# EAGLE design MusicGloves (EAGLE 9.6.2)
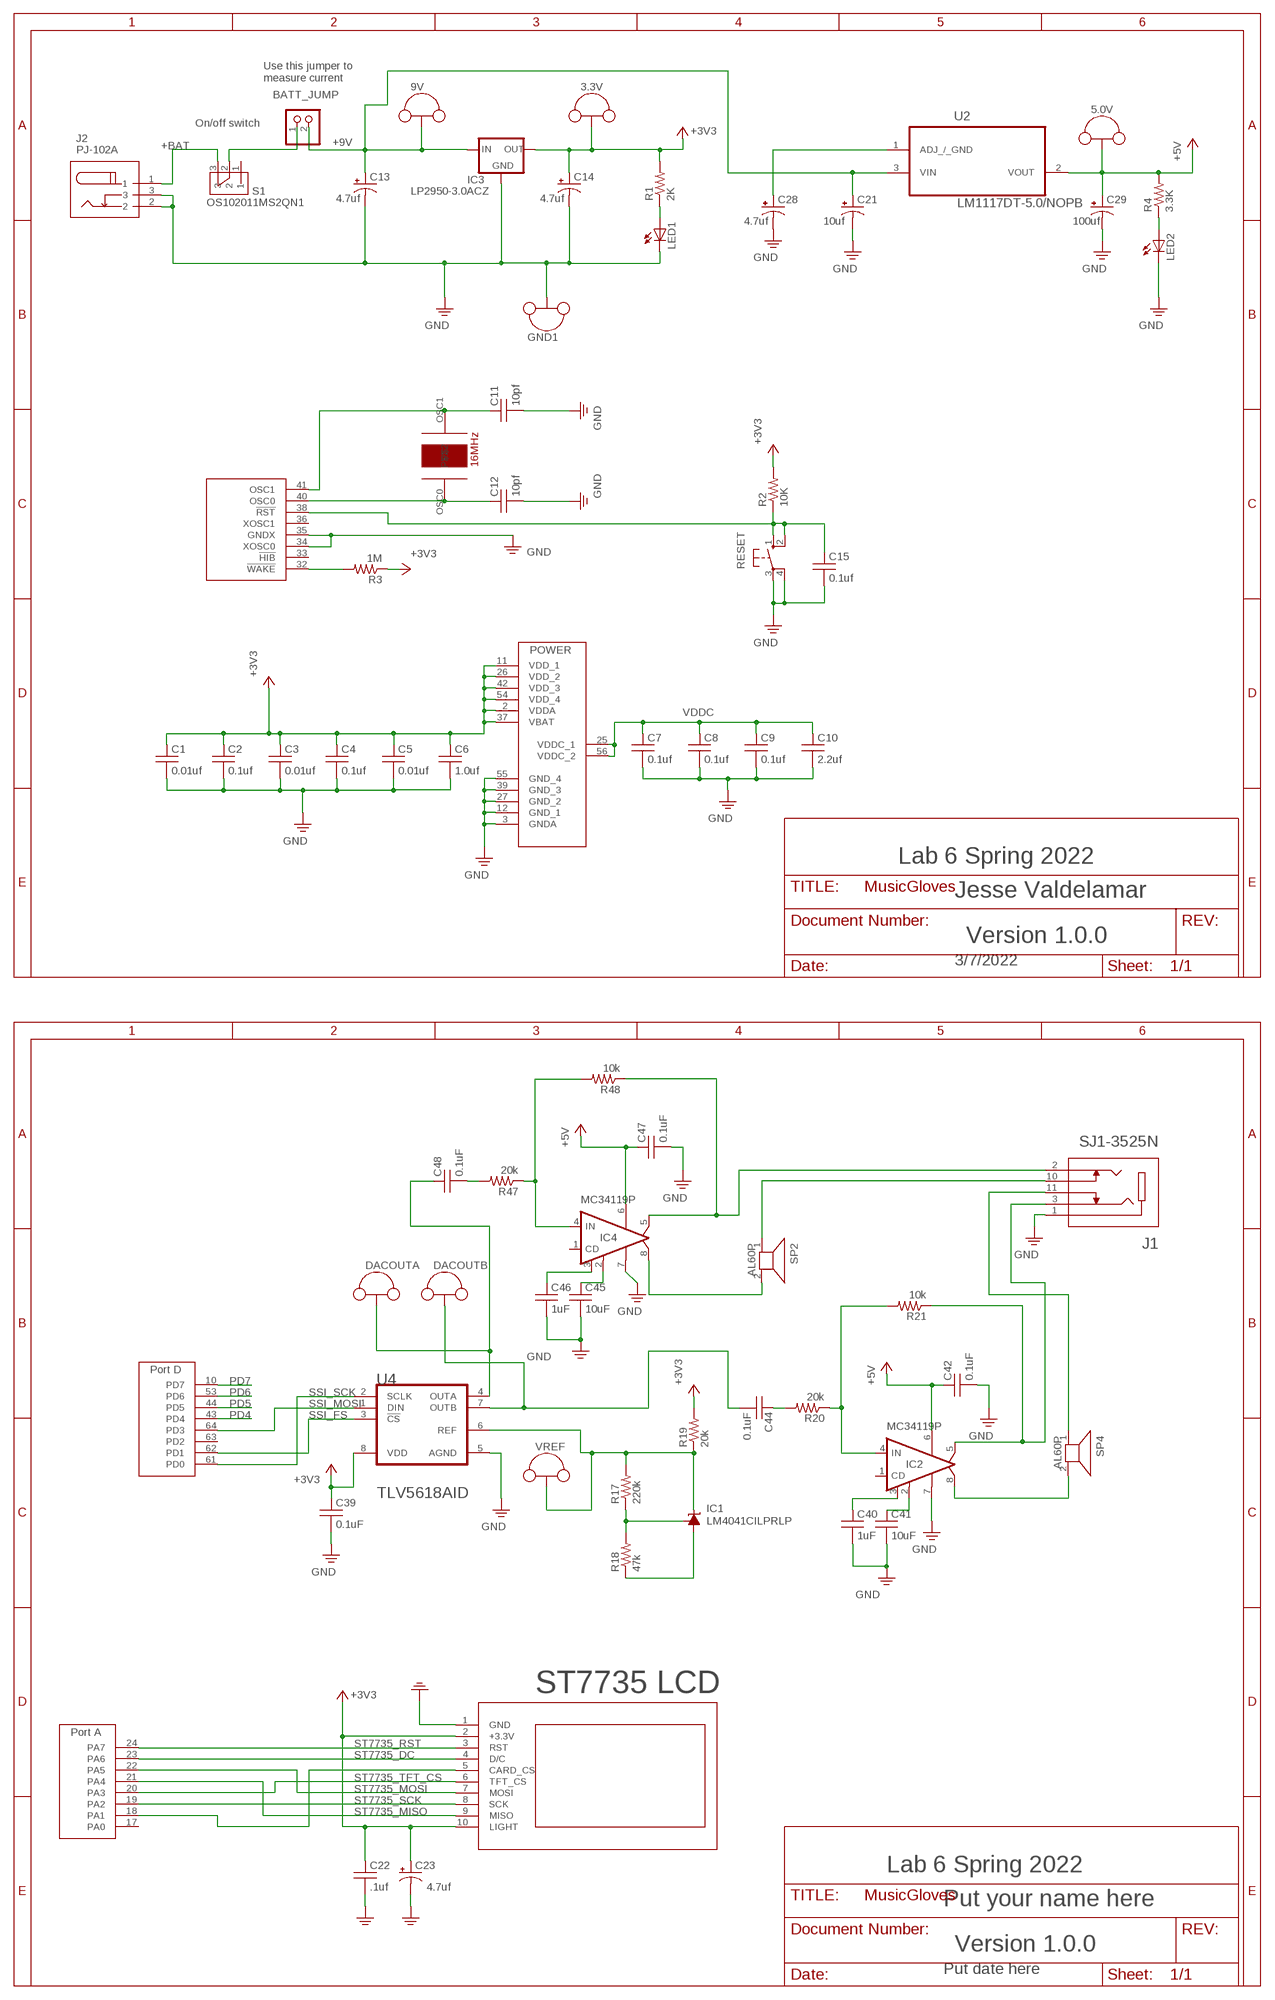
[diagram p0: schematic, sheet 1, part 1 of 2]
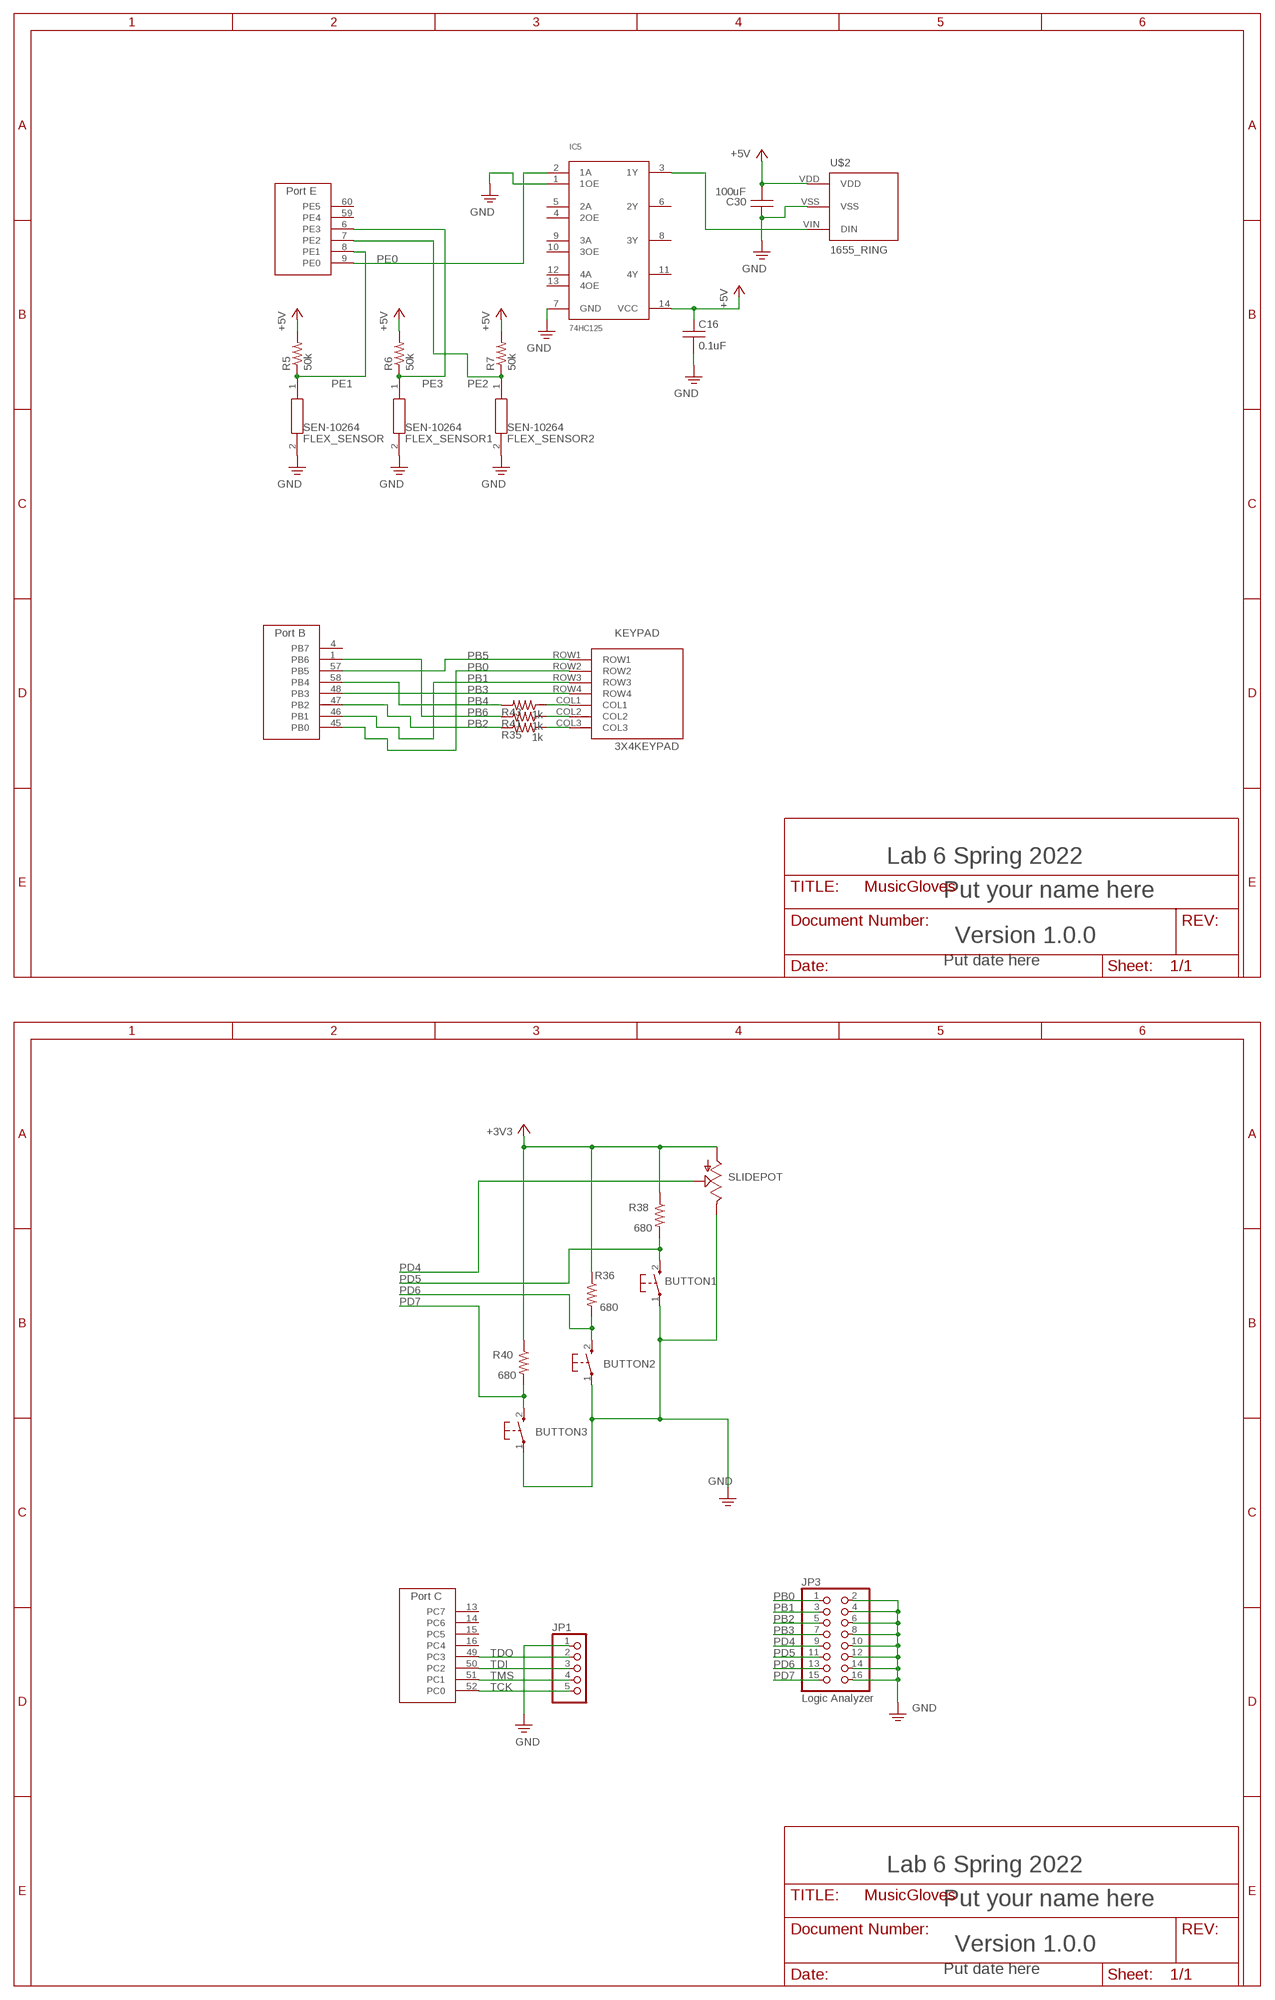
[diagram p1: schematic, sheet 1, part 2 of 2]

## Parts
3.3V  TP_LOOP  [TP_LOOP]
5.0V  TP_LOOP  [TP_LOOP]
9V  TP_LOOP  [TP_LOOP]
BATT_JUMP  PINHD-1X2  [1X02]
BUTTON1  B3F_1052_2HOLE  [B3F-10XX_2HOLE]
BUTTON2  B3F_1052_2HOLE  [B3F-10XX_2HOLE]
BUTTON3  B3F_1052_2HOLE  [B3F-10XX_2HOLE]
C1  0.01uf  CAPACITOR025-024X044  [CAP100MIL]
C2  0.1uf  CAPACITOR025-024X044  [CAP100MIL]
C3  0.01uf  CAPACITOR025-024X044  [CAP100MIL]
C4  0.1uf  CAPACITOR025-024X044  [CAP100MIL]
C5  0.01uf  CAPACITOR025-024X044  [CAP100MIL]
C6  1.0uf  CAPACITOR025-024X044  [CAP100MIL]
C7  0.1uf  CAPACITOR025-024X044  [CAP100MIL]
C8  0.1uf  CAPACITOR025-024X044  [CAP100MIL]
C9  0.1uf  CAPACITOR025-024X044  [CAP100MIL]
C10  2.2uf  CAPACITOR025-024X044  [CAP100MIL]
C11  10pf  CAPACITOR025-024X044  [CAP100MIL]
C12  10pf  CAPACITOR025-024X044  [CAP100MIL]
C13  4.7uf  CAPACITOR_POLARIZEDE5-6  [CAP200MILPOLARIZED]
C14  4.7uf  CAPACITOR_POLARIZEDE5-6  [CAP200MILPOLARIZED]
C15  0.1uf  CAPACITOR025-024X044  [CAP100MIL]
C16  0.1uF  CAPACITOR050-024X044  [CAP200MIL]
C21  10uf  CAPACITOR_POLARIZEDE5-6  [CAP200MILPOLARIZED]
C22  .1uf  CAPACITOR050-024X044  [CAP200MIL]
C23  4.7uf  CAPACITOR_POLARIZEDE5-6  [CAP200MILPOLARIZED]
C28  4.7uf  CAPACITOR_POLARIZEDE5-6  [CAP200MILPOLARIZED]
C29  100uf  CAPACITOR_POLARIZEDE5-6  [CAP200MILPOLARIZED]
C30  100uF  CAPACITOR050-024X044  [CAP200MIL]
C39  0.1uF  CAPACITOR050-024X044  [CAP200MIL]
C40  1uF  CAPACITOR050-024X044  [CAP200MIL]
C41  10uF  CAPACITOR050-024X044  [CAP200MIL]
C42  0.1uF  CAPACITOR050-024X044  [CAP200MIL]
C44  0.1uF  CAPACITOR050-024X044  [CAP200MIL]
C45  10uF  CAPACITOR050-024X044  [CAP200MIL]
C46  1uF  CAPACITOR050-024X044  [CAP200MIL]
C47  0.1uF  CAPACITOR050-024X044  [CAP200MIL]
C48  0.1uF  CAPACITOR050-024X044  [CAP200MIL]
DACOUTA  TP_LOOP  [TP_LOOP]
DACOUTB  TP_LOOP  [TP_LOOP]
FLEX_SENSOR  SEN-10264  [RESAD2700W1900L700D500]
FLEX_SENSOR1  SEN-10264  [RESAD2700W1900L700D500]
FLEX_SENSOR2  SEN-10264  [RESAD2700W1900L700D500]
GND1  TP_LOOP  [TP_LOOP]
IC1  LM4041CILPRLP  [LP_O-PBCY-W3]
IC2  MC34119P  [DIL08]
IC3  LP2950-3.0ACZ  [TO92]
IC4  MC34119P  [DIL08]
IC5  74HC125  [SOIC-14]
J1  SJ1-3525N  [CUI_SJ1-3525N]
J2  PJ-102A  [PJ-102AH]
JP1  PINHD-1X5  [1X05]
JP3  Logic Analyzer  PINHD-2X8  [2X08]
KEYPAD  3X4KEYPAD  [3X4KEYPAD]
LED1  LED3MM  [LED3MM]
LED2  LED3MM  [LED3MM]
R1  2K  RESISTOR0204/5  [RES200MIL]
R2  10K  RESISTOR0204/5  [RES200MIL]
R3  1M  RESISTOR0204/5  [RES200MIL]
R4  3.3K  RESISTOR0204/5  [RES200MIL]
R5  50k  RESISTOR0204/5  [RES200MIL]
R6  50k  RESISTOR0204/5  [RES200MIL]
R7  50k  RESISTOR0204/5  [RES200MIL]
R17  220k  RESISTOR0204/5  [RES200MIL]
R18  47k  RESISTOR0204/5  [RES200MIL]
R19  20k  RESISTOR0204/5  [RES200MIL]
R20  20k  RESISTOR0204/5  [RES200MIL]
R21  10k  RESISTOR0204/5  [RES200MIL]
R35  1k  R-US_0204/5  [0204/5]
R36  680  R-US_0204/5  [0204/5]
R38  680  R-US_0204/5  [0204/5]
R40  680  R-US_0204/5  [0204/5]
R41  1k  R-US_0204/5  [0204/5]
R43  1k  R-US_0204/5  [0204/5]
R47  20k  RESISTOR0204/5  [RES200MIL]
R48  10k  RESISTOR0204/5  [RES200MIL]
RESET  B3F-1052  [B3F-10XX]
S1  OS102011MS2QN1  [SW_OS102011MS2QN1]
SLIDEPOT  POTENTIOMETER_PTA2043B25U  [PTA2043]
SP2  AL60P  [AL60P]
SP4  AL60P  [AL60P]
U1  TM4C123GH6PM  [QFP50P1200X1200X160-64N]
U2  LM1117DT-5.0/NOPB  [TO228P970X238-3N]
U4  TEXAS_INSTRUMENTS_TLV5618AIDTEXAS_INSTRUMENTS_TLV5618AID_0_0  [TEXAS_INSTRUMENTS_TLV5618AID_0]
U$2  1655_RING  [LED_1655_RING]
U$3  ST7735  [ST7735]
VREF  TP_LOOP  [TP_LOOP]
Y1  16MHZ_CRYSTAL  [16MHZ_CRYSTAL]

## Nets
+3V1: IC1.2(C) R17.2 R19.1 U4.6(REF) VREF.P$1(TP) VREF.P$2(TP)
+3V2: C48.1 DACOUTA.P$1(TP) DACOUTA.P$2(TP) U4.4(OUTA)
+3V3: 3.3V.P$1(TP) 3.3V.P$2(TP) C1.1 C2.1 C3.1 C4.1 C5.1 C6.1 C14.+ C22.1 C23.+ C39.1 IC3.1(OUT) R1.2 R2.2 R3.1 R19.2 R36.1 R38.1 R40.1 SLIDEPOT.3(A) U1.2(VDDA) U1.11(VDD_1) U1.26(VDD_2) U1.37(VBAT) U1.42(VDD_3) U1.54(VDD_4) U4.8(VDD) U$3.2(+3.3V) U$3.10(LIGHT)
+3V4: C44.2 DACOUTB.P$1(TP) DACOUTB.P$2(TP) U4.7(OUTB)
+5V: 5.0V.P$1(TP) 5.0V.P$2(TP) C16.1 C29.+ C30.2 C42.1 C47.1 IC2.6(VCC) IC4.6(VCC) IC5.14(VCC) R4.2 R5.2 R6.2 R7.2 U2.2(VOUT) U$2.VDD
+9V: 9V.P$1(TP) 9V.P$2(TP) BATT_JUMP.2 C13.+ C21.+ IC3.3(IN) U2.3(VIN)
+BAT: J2.1 S1.3
COL1: KEYPAD.COL1 R43.1
COL2: KEYPAD.COL2 R41.1
COL3: KEYPAD.COL3 R35.1
GND: BUTTON1.1(P) BUTTON2.1(P) BUTTON3.1(P) C1.2 C2.2 C3.2 C4.2 C5.2 C6.2 C7.2 C8.2 C9.2 C10.2 C11.2 C12.2 C13.- C14.- C15.2 C16.2 C21.- C22.2 C23.- C28.- C29.- C30.1 C39.2 C40.2 C41.2 C42.2 C45.2 C46.2 C47.2 FLEX_SENSOR1.2 FLEX_SENSOR2.2 FLEX_SENSOR.2 GND1.P$1(TP) GND1.P$2(TP) IC2.7(GND) IC3.2(GND) IC4.7(GND) IC5.1(1OE) IC5.7(GND) J1.1 J2.2 J2.3 JP1.1 JP3.2 JP3.4 JP3.6 JP3.8 JP3.10 JP3.12 JP3.14 JP3.16 LED1.K(C) LED2.K(C) RESET.3(P) RESET.4(P1) SLIDEPOT.1(E) U1.3(GNDA) U1.12(GND_1) U1.27(GND_2) U1.34(XOSC0) U1.35(GNDX) U1.39(GND_3) U1.55(GND_4) U4.5(AGND) U$2.VSS U$3.1(GND)
N$1: J1.10 SP2.1
N$3: J1.11 SP4.1
N$4: C44.1 R20.2
N$5: C28.+ U2.1(ADJ_/_GND)
N$6: IC2.4(IN) R20.1 R21.2
N$9: IC2.8(VO2) SP4.2
N$10: C41.1 IC2.2(FC2)
N$12: C40.1 IC2.3(FC1)
N$13: U1.18(PA1) U$3.5(CARD_CS)
N$16: IC5.3(1Y) U$2.VIN(DIN)
N$30: C48.2 R47.2
N$65: IC4.4(IN) R47.1 R48.2
N$68: IC4.8(VO2) SP2.2
N$69: C45.1 IC4.2(FC2)
N$70: C46.1 IC4.3(FC1)
OSC0: C12.1 U1.40(OSC0) Y1.OSC0
OSC1: C11.1 U1.41(OSC1) Y1.OSC1
PB0: JP3.1 KEYPAD.ROW2 U1.45(PB0)
PB1: JP3.3 KEYPAD.ROW3 U1.46(PB1)
PB2: JP3.5 R35.2 U1.47(PB2)
PB3: JP3.7 KEYPAD.ROW4 U1.48(PB3)
PB4: R43.2 U1.58(PB4)
PB5: KEYPAD.ROW1 U1.57(PB5)
PB6: R41.2 U1.1(PB6)
PD4: JP3.9 SLIDEPOT.2(S) U1.43(PD4)
PD5: BUTTON1.2(S) JP3.11 R38.2 U1.44(PD5)
PD6: BUTTON2.2(S) JP3.13 R36.2 U1.53(PD6)
PD7: BUTTON3.2(S) JP3.15 R40.2 U1.10(PD7)
PE0: IC5.2(1A) U1.9(PE0)
PE1: FLEX_SENSOR.1 R5.1 U1.8(PE1)
PE2: FLEX_SENSOR2.1 R7.1 U1.7(PE2)
PE3: FLEX_SENSOR1.1 R6.1 U1.6(PE3)
POWERLED: LED1.A R1.1
POWERLED1: LED2.A R4.1
POWERLED3: IC4.5(VO1) J1.2 R48.1
POWERLED14: IC1.1(FB) R17.1 R18.2
POWERLED15: IC1.3(A) R18.1
POWERLED17: IC2.5(VO1) J1.3 R21.1
RESET: C15.1 R2.1 RESET.1(S) RESET.2(S1) U1.38(!RST)
SSI_FS: U1.62(PD1) U4.3(!CS!)
SSI_MOSI: U1.64(PD3) U4.1(DIN)
SSI_SCK: U1.61(PD0) U4.2(SCLK)
ST7735_DC: U1.23(PA6) U$3.4(D/C)
ST7735_MISO: U1.21(PA4) U$3.9(MISO)
ST7735_MOSI: U1.22(PA5) U$3.7(MOSI)
ST7735_RST: U1.24(PA7) U$3.3(RST)
ST7735_SCK: U1.19(PA2) U$3.8(SCK)
ST7735_TFT_CS: U1.20(PA3) U$3.6(TFT_CS)
SWITCHEDPOWER: BATT_JUMP.1 S1.2
TCK: JP1.5 U1.52(PC0)
TDI: JP1.3 U1.50(PC2)
TDO: JP1.2 U1.49(PC3)
TMS: JP1.4 U1.51(PC1)
VDDC: C7.1 C8.1 C9.1 C10.1 U1.25(VDDC_1) U1.56(VDDC_2)
WAKE: R3.2 U1.32(!WAKE)
Unconnected: IC2.1(CD) IC4.1(CD) IC5.4(2OE) IC5.5(2A) IC5.6(2Y) IC5.8(3Y) IC5.9(3A) IC5.10(3OE) IC5.11(4Y) IC5.12(4A) IC5.13(4OE) S1.1 U1.4(PB7) U1.5(PF4) U1.13(PC7) U1.14(PC6) U1.15(PC5) U1.16(PC4) U1.17(PA0) U1.28(PF0) U1.29(PF1) U1.30(PF2) U1.31(PF3) U1.33(!HIB) U1.36(XOSC1) U1.59(PE4) U1.60(PE5) U1.63(PD2)

## Notes on the sheet
- Use this jumper to
  measure current
- On/off switch
- Lab 6 Spring 2022 | Lab 6 Spring 2022
- Jesse Valdelamar | Put your name here
- Version 1.0.0 | Version 1.0.0
- 3/7/2022 | Put date here
- ST7735 LCD
- Lab 6 Spring 2022 | Lab 6 Spring 2022
- Put your name here | Put your name here
- Version 1.0.0 | Version 1.0.0
- Put date here | Put date here

## Library data of the parts
3.3V 5.0V 9V DACOUTA DACOUTB GND1 VREF = EE445L:TP_LOOP
BATT_JUMP = EE445L:PINHD-1X2: PIN HEADER
BUTTON1-BUTTON3 = EE445L:B3F_1052_2HOLE
C1-C12 C15 C16 C22 C30 C39-C42 C44-C48 = EE445L:CAPACITOR: CAPACITOR, American symbol
C13 C14 C21 C23 C28 C29 = EE445L:CAPACITOR_POLARIZED: POLARIZED CAPACITOR, American symbol
FLEX_SENSOR FLEX_SENSOR1 FLEX_SENSOR2 = SEN-10264:SEN-10264: Multiple Function Sensor Development Tools Flex Sensor 2.2"" Source: Datasheet <https://cdn.sparkfun.com/assets/9/5/b/f/7/FLEX_SENSOR_-_SPECIAL_EDITION_DATA_SHEET_v2019__Rev_A_.pdf>; DESCRIPTION: Multiple Function Sensor Development Tools Flex Sensor 2.2""; HEIGHT: mm; MANUFACTURER_NAME: SparkFun; MANUFACTURER_PART_NUMBER: SEN-10264
IC1 = LM4041CILPR:LM4041CILPR: PRECISION MICROPOWER SHUNT VOLTAGE REFERENCE Adjustable Output Source: http://focus.ti.com/lit/ds/slcs146e/slcs146e.pdf LM4041CILPR Let R1 be the resistor from Vref to +3.3V Let R2 be the resistor from Vref to FB Let R3 be the resistor from FB to ground Vref = 1.23*(1+R3/R2) Iref=(3.3V-Vref)/R1 - 100uA; DESCRIPTION: Adjustable, precision micropower shunt voltage reference with 0.5% accuracy 3-TO-92 -40 to 85; DIGI-KEY_PART_NUMBER: 296-22173-1-ND; MF: Texas Instruments; MP: LM4041CILPR; PACKAGE: TO-92-3 Texas Instruments; PURCHASE-URL: https://pricing.snapeda.com/search/part/LM4041CILPR/?ref=eda
IC2 IC4 = MC34119:MC34119: Low Power Audio Amplifier Motorola Check availability <https://pricing.snapeda.com/parts/MC34119/NXP%20Semiconductors/view-part?ref=eda>; AVAILABILITY: In Stock; DESCRIPTION: Amplifier IC 1-Channel (Mono) Class AB 8-TSSOP; MF: NXP Semiconductors; MP: MC34119; PACKAGE: TSSOP-8 NXP / Freescale; PRICE: None
IC3 = EE445L:LP2950: LP2950 3.3V regulator, 100 mA TO-92 On Semiconductor LP2950ACZ-3.3G, Mouser 863-LP2950ACZ-3.3G
IC5 = 74HC125:74HC125: Check availability <https://pricing.snapeda.com/parts/74HC125/Nexperia%20USA/view-part?ref=eda>; AVAILABILITY: In Stock; DESCRIPTION: Buffer, Non-Inverting 4 Element 1 Bit per Element 3-State Output 14-TSSOP; MF: Nexperia USA; MP: 74HC125; PACKAGE: SOIC-14 STMicroelectronics; PRICE: None; PURCHASE-URL: https://pricing.snapeda.com/search/part/74HC125/?ref=eda
J1 = SJ1-3525N:SJ1-3525N: 3.5 mm Right-Angle Stereo Jack, 5 Pin PCB Mount, Non-Threaded; MANUFACTURER: CUI; PARTREV: 1.02; STANDARD: Manufacturer recommendation
J2 = PJ-102A:PJ-102A: DC Power Connectors Power Jacks Source: Datasheet <https://www.cui.com/product/resource/pj-102a.pdf>; DESCRIPTION: DC Power Connectors Power Jacks; HEIGHT: mm; MANUFACTURER_NAME: CUI Inc.; MANUFACTURER_PART_NUMBER: PJ-102A; MOUSER_PART_NUMBER: 490-PJ-102A; MOUSER_PRICE-STOCK: https://www.mouser.co.uk/ProductDetail/CUI-Devices/PJ-102A?qs=WyjlAZoYn50UKjtnxOz%252Bqg%3D%3D
JP1 = EE445L:PINHD-1X5: PIN HEADER
JP3 = EE445L:PINHD-2X8: PIN HEADER
KEYPAD = SparkfunQwiicKeypad:3X4KEYPAD
LED1 LED2 = EE445L:LED: Avago Technologies LED Green 2mA 5mm diffused, HLMP-4740, Digikey 516-1327-ND Red 1.6V 1mA 5mm diffused, HLMP-D150, Digikey 516-1323-ND Yellow 2mA 5mm diffused, HLMP-4719, Digikey 516-1326-ND Orange 10mA 5mm diffused HLMP-D401, Digikey 516-1330-ND Blue 10mA 5mm diffused
R1-R7 R17-R21 R47 R48 = EE445L:RESISTOR: RESISTOR, American symbol
R35 R36 R38 R40 R41 R43 = rcl:R-US_: RESISTOR, American symbol; SPICEPREFIX: R
RESET = EE445L:B3F-1052: OMRON SWITCH 1.1mm holes; MPN: B3F-1000; OC_FARNELL: 176432; OC_NEWARK: 36M3542
S1 = OS102011MS2QN1:OS102011MS2QN1: Switch Slide ON ON SPDT Top Slide 0.1A 12VDC 10000Cycles PC Pins Thru-Hole Bulk Check availability <https://pricing.snapeda.com/parts/OS102011MS2QN1/C%26K/view-part?ref=eda>; AVAILABILITY: In Stock; DESCRIPTION: SLIDE SWITCH SPDT T/H ON-ON BBM; MF: C&K; MP: OS102011MS2QN1; PACKAGE: None; PRICE: None; PURCHASE-URL: https://pricing.snapeda.com/search/part/OS102011MS2QN1/?ref=eda
SLIDEPOT = EE445L:POTENTIOMETER_PTA2043: POTENTIOMETER Warning There are many many sizes and shapes of potentiometers. Please verify both the wiring and the physical layout of your pots.
SP2 SP4 = buzzer2:AL60P: SPEAKER Source: Buerklin; OC_FARNELL: unknown; OC_NEWARK: unknown
U1 = EE445L:TM4C123GH6PM
U2 = LM1117DT-5.0_NOPB:LM1117DT-5.0/NOPB: IC, LDO VOLT REG, 3.3V, 0.8A Check availability <https://pricing.snapeda.com/parts/LM1117DT-5.0/NOPB/Texas%20Instruments/view-part?ref=eda>; AVAILABILITY: In Stock; DESCRIPTION: 800-mA 15-V linear voltage regulator 3-TO-252 0 to 125; MF: Texas Instruments; MP: LM1117DT-5.0/NOPB; PACKAGE: TO-252-3 Texas Instruments; PRICE: None; PURCHASE-URL: https://pricing.snapeda.com/search/part/LM1117DT-5.0/NOPB/?ref=eda
U4 = Texas Instruments - TLV5618AID:TEXAS_INSTRUMENTS_TLV5618AID: TI-TLV561X_5638-8; CIIVA_IDS: 1089365; CODE__JEDEC: MS-012; COMPONENT_LINK_1_DESCRIPTION: Manufacturer URL; COMPONENT_LINK_1_URL: http://www.ti.com/; COMPONENT_LINK_3_DESCRIPTION: Package Specification; COMPONENT_LINK_3_URL: http://www.ti.com/litv/pdf/msoi002j; DAC_CHANNELS: 2; DATASHEET: http://www.ti.com/general/docs/lit/getliterature.tsp?genericPartNumber=TLV5618A&fileType=pdf; DATASHEET_VERSION: SLAS230H; DNL_MAX__LSB: 1; FOOTPRINT_VARIANT_NAME_0: Level C; FOOTPRINT_VARIANT_NAME_1: Level B; FOOTPRINT_VARIANT_NAME_2: Level A; IMPORTED: yes; IMPORTED_FROM: vault; IMPORT_TS: 1521848973; INL_MAX__LSB: 4; INTERFACE: Serial SPI; MF: Texas Instruments; MOUNTING_TECHNOLOGY: Surface Mount; MPN: TLV5618AID; PACKAGE: D8; PACKAGE_DESCRIPTION: 8-Pin Plastic Small Outline, Body 4.9 x 3.9 mm, Pitch 1.27 mm; PACKAGE_VERSION: 4040047-3/M, 06/2011; PIN_0_0_1_INSIDE_EDGE: clock; POWER_CONSUMPTIONTYPMW: 1.8; PREFIX: U; RELEASE_DATE: 1386925073; RESOLUTION_BITS: 12; ROHS: Yes; SETTLING_TIMEUS: 3; SFDRD_B: 72; SNRD_B: 76; SUB_FAMILY: Precision DAC (=<10MSPS); VAULT_GUID: 013B0FB3-B93C-4793-8784-9A2B0464A527; VAULT_REVISION: B618AF77-08DF-4618-A484-169F78FA430F
U$2 = SK6812:1655_RING
U$3 = EE445L:ST7735
Y1 = EE445L:16MHZ_CRYSTAL

## Board
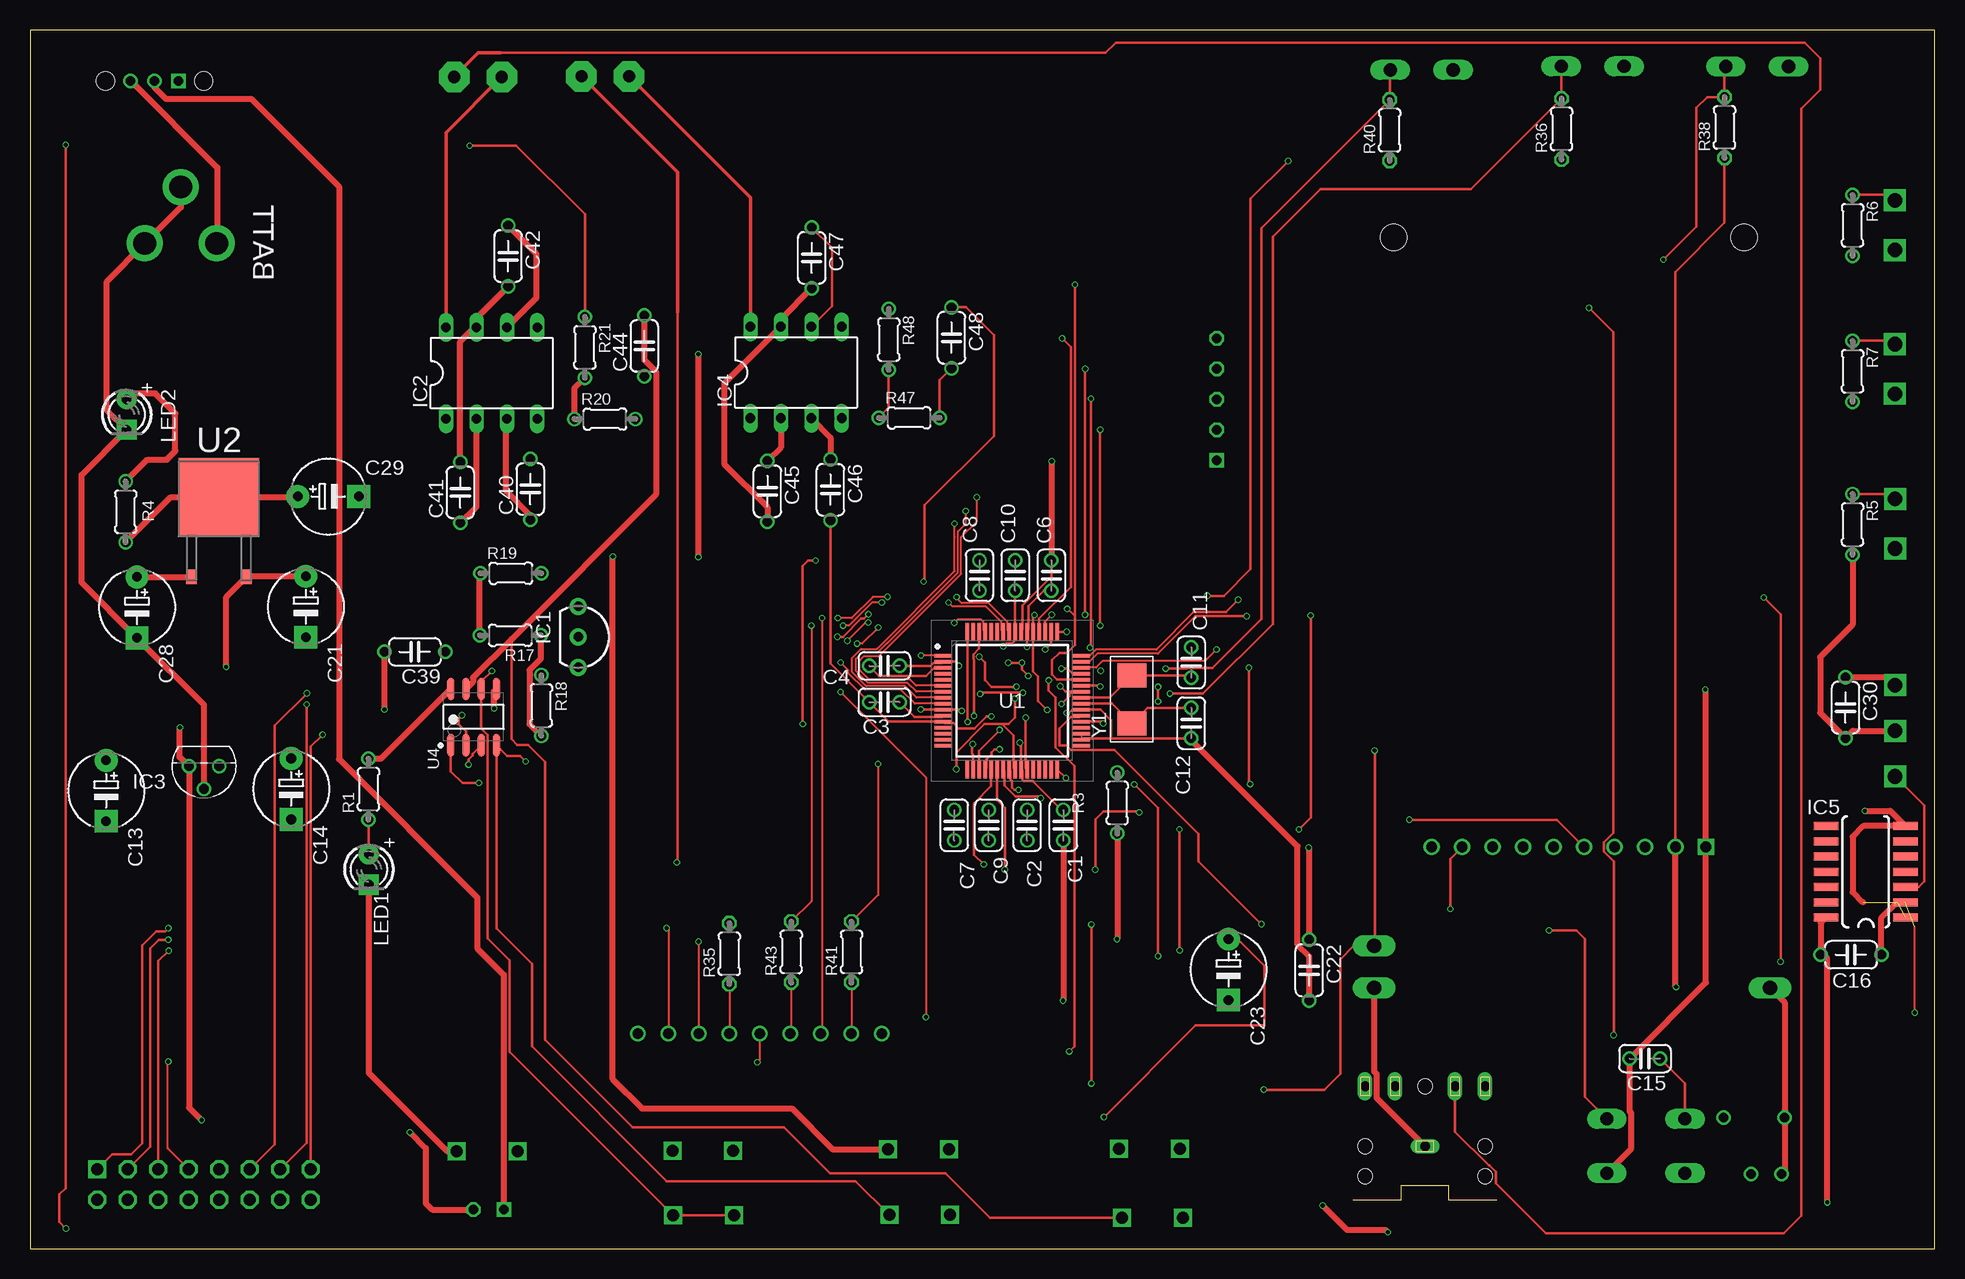
[diagram p2: board, top side]
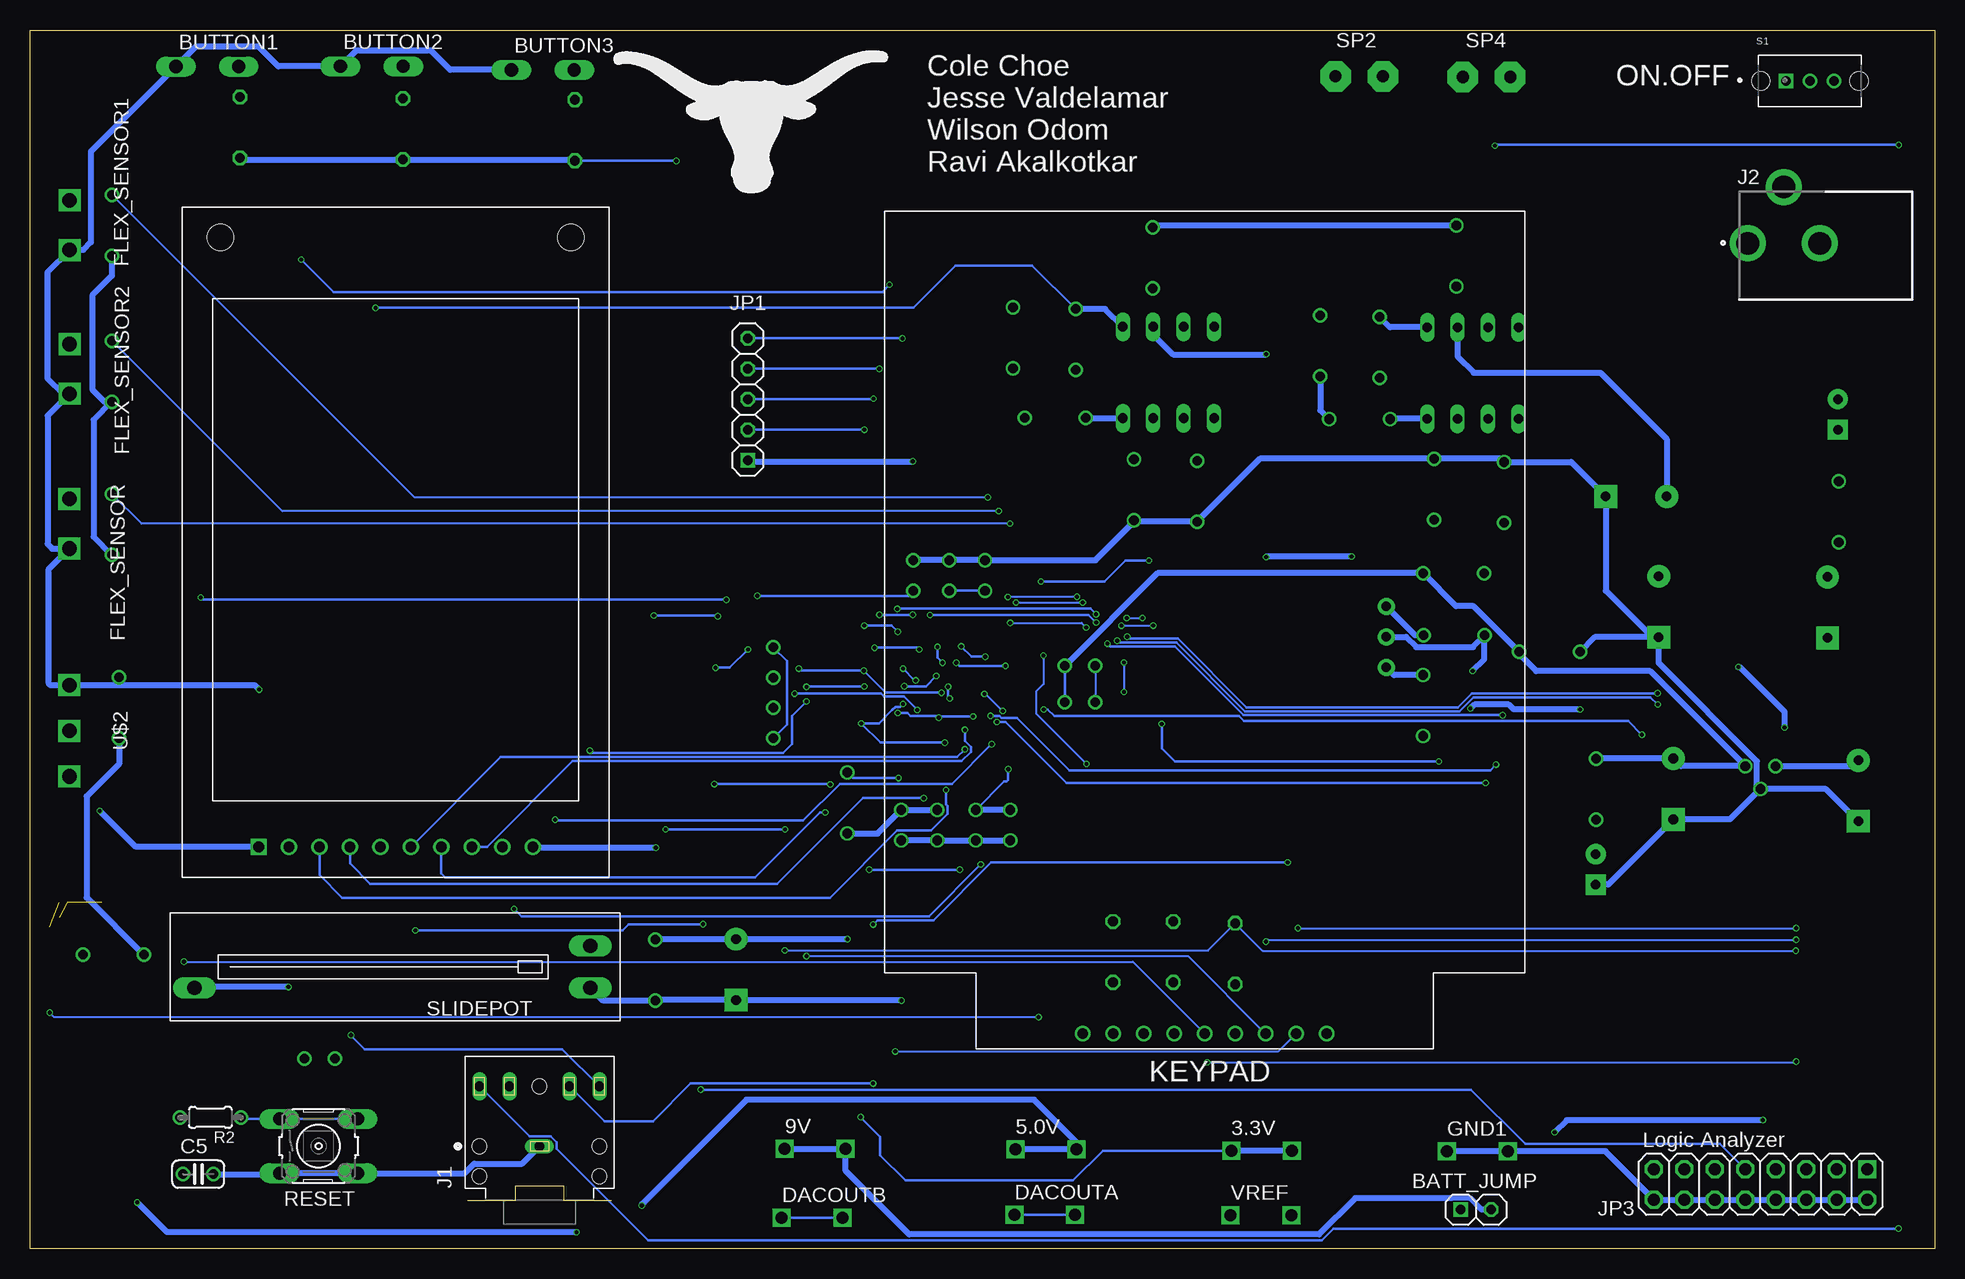
[diagram p3: board, bottom side, seen from below]

Size 158.75 x 101.6 mm. Coordinates in mm from the lower left corner, seen from the top.
Outline: 158.75,0 158.75,101.6 0,101.6 0,0 158.75,0
Copper layers (1*16): Top 0.035559375mm / dielectric 1.6mm / Bottom 0.035559375mm
Design rules "jlcpcb2layer": minimum track width 5mil, minimum drill 12mil, track to track 5mil, track to pad 5mil, pad to pad 5mil, via to via 5mil, smd to smd 5mil, copper to edge 8mil, drill to drill 6mil, minimum pad ring 5mil, minimum via ring 3mil, stop-mask expansion 2.5mil, vias tented up to drill 0mil, thermal gap 10mil

### Footprints (pad centres in the part's own frame; a part is rotated, then mirrored left to right if it is on the bottom)
TP_LOOP = drill 1 square: P$1 0,0; P$2 5.08,0
1X02 = drill 0.8 square: 1 -1.27,0 | drill 0.8 octagon: 2 1.27,0
B3F-10XX_2HOLE = drill 1.1 long: 1 -1.981,-0.279; 2 3.251,-0.279
CAP100MIL = drill 0.8: 1 -1.27,0; 2 1.27,0
CAP200MILPOLARIZED = drill 0.8 pad 1.905: + -2.54,0 | drill 0.8 pad 1.905 square: - 2.54,0
CAP200MIL = drill 0.8: 1 -2.54,0; 2 2.54,0
RESAD2700W1900L700D500 = drill 1.219 square: 1 0,0; 2 4.14,0
LP_O-PBCY-W3 = drill 0.8 pad 1.4: 1 -2.54,0; 2 0,0; 3 2.54,0
DIL08 = drill 0.813 long: 1 -3.81,-3.81; 2 -1.27,-3.81; 3 1.27,-3.81; 4 3.81,-3.81; 5 3.81,3.81; 6 1.27,3.81; 7 -1.27,3.81; 8 -3.81,3.81
TO92 = drill 0.8: 1 -1.27,0; 2 0,1.905; 3 1.27,0
SOIC-14 = smd 0.66 x 2.032: 1 0,-0.775; 2 1.27,-0.775; 3 2.54,-0.775; 4 3.81,-0.775; 5 5.08,-0.775; 6 6.35,-0.775; 7 7.62,-0.775; 8 7.62,5.855; 9 6.35,5.855; 10 5.08,5.855; 11 3.81,5.855; 12 2.54,5.855; 13 1.27,5.855; 14 0,5.855
CUI_SJ1-3525N = drill 0.8 long: 1 0,0; 2 5,-5; 3 5,5; 10 5,-2.5; 11 5,2.5 | hole 1.2: -2.5,5; 0,5; 5,0; -2.5,-5; 0,-5
PJ-102AH = drill 1.9 pad 3: 1 4.3,-3; 2 4.3,3; 3 -0.4,0
1X05 = drill 0.8 square: 1 -5.08,0 | drill 0.8 octagon: 2 -2.54,0; 3 0,0; 4 2.54,0; 5 5.08,0
2X08 = drill 1 square: 1 -8.89,-1.27 | drill 1 octagon: 2 -8.89,1.27; 3 -6.35,-1.27; 4 -6.35,1.27; 5 -3.81,-1.27; 6 -3.81,1.27; 7 -1.27,-1.27; 8 -1.27,1.27; 9 1.27,-1.27; 10 1.27,1.27; 11 3.81,-1.27; 12 3.81,1.27; 13 6.35,-1.27; 14 6.35,1.27; 15 8.89,-1.27; 16 8.89,1.27
3X4KEYPAD = drill 0.85: COL1 24.13,-68.58; COL2 19.05,-68.58; COL3 29.21,-68.58; P$1 16.51,-68.58; P$9 36.83,-68.58; ROW1 21.59,-68.58; ROW2 34.29,-68.58; ROW3 31.75,-68.58; ROW4 26.67,-68.58
LED3MM = drill 0.8 pad 1.676: A -1.27,0 | drill 0.8 pad 1.676 square: K 1.27,0
RES200MIL = drill 0.8: 1 -2.54,0; 2 2.54,0
0204/5 = drill 0.813 octagon: 1 -2.54,0; 2 2.54,0
B3F-10XX = drill 1.1 long: 1 -3.251,2.261; 2 3.251,2.261; 3 -3.251,-2.261; 4 3.251,-2.261
SW_OS102011MS2QN1 = drill 0.8 square: 1 -2,0 | drill 0.8: 2 0,0; 3 2,0 | hole 1.5: -4.1,0; 4.1,0
PTA2043 = drill 1.194 long: 1 -13,1.75; 2 -13,-1.75; 3 20,1.75
AL60P = drill 1.016 pad 2.54 octagon: 1 -0.711,0; 2 3.251,0
QFP50P1200X1200X160-64N = smd 1.475 x 0.3: 1 -5.738,3.75; 2 -5.738,3.25; 3 -5.738,2.75; 4 -5.738,2.25; 5 -5.738,1.75; 6 -5.738,1.25; 7 -5.738,0.75; 8 -5.738,0.25; 9 -5.738,-0.25; 10 -5.738,-0.75; 11 -5.738,-1.25; 12 -5.738,-1.75; 13 -5.738,-2.25; 14 -5.738,-2.75; 15 -5.738,-3.25; 16 -5.738,-3.75; 33 5.738,-3.75; 34 5.738,-3.25; 35 5.738,-2.75; 36 5.738,-2.25; 37 5.738,-1.75; 38 5.738,-1.25; 39 5.738,-0.75; 40 5.738,-0.25; 41 5.738,0.25; 42 5.738,0.75; 43 5.738,1.25; 44 5.738,1.75; 45 5.738,2.25; 46 5.738,2.75; 47 5.738,3.25; 48 5.738,3.75 | smd 0.3 x 1.475: 17 -3.75,-5.738; 18 -3.25,-5.738; 19 -2.75,-5.738; 20 -2.25,-5.738; 21 -1.75,-5.738; 22 -1.25,-5.738; 23 -0.75,-5.738; 24 -0.25,-5.738; 25 0.25,-5.738; 26 0.75,-5.738; 27 1.25,-5.738; 28 1.75,-5.738; 29 2.25,-5.738; 30 2.75,-5.738; 31 3.25,-5.738; 32 3.75,-5.738; 49 3.75,5.738; 50 3.25,5.738; 51 2.75,5.738; 52 2.25,5.738; 53 1.75,5.738; 54 1.25,5.738; 55 0.75,5.738; 56 0.25,5.738; 57 -0.25,5.738; 58 -0.75,5.738; 59 -1.25,5.738; 60 -1.75,5.738; 61 -2.25,5.738; 62 -2.75,5.738; 63 -3.25,5.738; 64 -3.75,5.738
TO228P970X238-3N = smd 0.889 x 1.219: 1 -2.286,-6.502; 3 2.286,-6.502 | smd 6.731 x 6.502: 2 0,0.152
TEXAS_INSTRUMENTS_TLV5618AID_0 = smd 1.9 x 0.6: 1 -2.35,1.905; 2 -2.35,0.635; 3 -2.35,-0.635; 4 -2.35,-1.905; 5 2.35,-1.905; 6 2.35,-0.635; 7 2.35,0.635; 8 2.35,1.905
LED_1655_RING = drill 1.219 square: VDD 2.54,0; VIN -1.27,0; VSS 6.35,0
ST7735 = drill 0.9 square: 1 0,0 | drill 0.9: 2 0,-2.54; 3 0,-5.08; 4 0,-7.62; 5 0,-10.16; 6 0,-12.7; 7 0,-15.24; 8 0,-17.78; 9 0,-20.32; 10 0,-22.86 | hole 2.184: 50.8,3.175; 50.8,-26.035
16MHZ_CRYSTAL = smd 2 x 2.4: OSC0 1,1.27; OSC1 5,1.27

### Placement (x,y rotation side)
3.3V  58.62,8.18 0 bottom
5.0V  76.61,8.28 0 bottom
9V  95.83,8.33 0 bottom
BATT_JUMP  38.23,3.25 0 bottom
BUTTON1  144.6,98.83 0 bottom
BUTTON2  130.89,98.86 0 bottom
BUTTON3  116.64,98.55 0 bottom
C1  86.13,35.31 270 top
C2  83.11,35.31 270 top
C3  71.22,45.57 180 top
C4  71.22,48.59 180 top
C5  144.73,6.22 0 bottom
C6  85.14,56.13 90 top
C7  77.04,35.31 270 top
C8  79.15,56.13 90 top
C9  79.91,35.31 270 top
C10  82.12,56.13 90 top
C11  96.8,48.87 90 top
C12  96.8,43.81 270 top
C13  6.35,38.18 270 top
C14  21.77,38.33 270 top
C15  134.62,15.85 180 top
C16  151.79,24.51 0 top
C21  22.99,53.52 270 top
C22  106.63,23.22 270 top
C23  99.9,23.27 270 top
C28  8.92,53.47 270 top
C29  24.87,62.71 0 top
C30  151.33,45.11 270 top
C39  32.08,49.76 180 top
C40  41.71,63.32 90 top
C41  35.86,63.04 90 top
C42  39.85,82.75 270 top
C44  51.21,75.26 90 top
C45  61.47,63.14 270 top
C46  66.73,63.27 270 top
C47  65.15,82.6 270 top
C48  76.81,75.95 270 top
DACOUTA  76.71,2.82 0 bottom
DACOUTB  96.09,2.59 0 bottom
FLEX_SENSOR  155.47,62.51 270 bottom
FLEX_SENSOR1  155.45,87.4 270 bottom
FLEX_SENSOR2  155.45,75.41 270 bottom
GND1  40.64,8.13 0 bottom
IC1  45.69,51 270 top
IC2  38.48,73 0 top
IC3  14.5,40.23 180 top
IC4  63.86,73.05 0 top
IC5  155.55,27.61 90 top
J1  116.28,8.53 90 bottom
J2  12.57,88.11 270 bottom
JP1  98.93,70.82 90 bottom
JP3  14.5,5.36 180 bottom
KEYPAD  87.5,86.51 0 bottom
LED1  28.24,31.62 270 top
LED2  8.05,69.55 270 top
R1  28.22,38.3 90 top
R2  143.71,10.95 180 bottom
R3  90.63,37.16 90 top
R4  7.98,61.44 270 top
R5  151.92,60.38 270 top
R6  151.92,85.32 270 top
R7  151.92,73.15 270 top
R17  40.03,51.13 180 top
R18  42.62,45.29 270 top
R19  40.08,56.31 0 top
R20  47.93,69.16 0 top
R21  46.25,75.13 270 top
R35  58.29,24.59 90 top
R36  127.66,93.34 90 top
R38  141.25,93.47 90 top
R40  113.33,93.24 90 top
R41  68.48,24.74 90 top
R43  63.45,24.74 90 top
R47  73.28,69.27 0 top
R48  71.58,75.79 270 top
RESET  134.7,8.56 0 bottom
S1  10.39,97.36 0 bottom
SLIDEPOT  125.04,23.5 180 bottom
SP2  46.69,97.74 0 top
SP4  36.07,97.69 0 top
U1  81.86,45.69 0 top
U2  15.75,62.51 0 top
U4  36.98,44.32 90 top
U$2  155.47,40.64 90 bottom
U$3  139.7,33.5 90 bottom
VREF  58.67,2.79 0 bottom
Y1  93.12,42.77 90 top

### Tracks (layer width: path | path; a pad name or v marks a point on that pad's centre or on a via)
+3V1  (via drill 0.35)
  Top 0.203: VREF.P$1 VREF.P$2 39.98,16.41 39.98,24.02 38.15,25.86 38.15,42.84 37.62,43.37 U4.6 37.62,47.27 v38.51,48.16
  Top 0.508: R17.2 37.49,56.26 R19.1
  Bottom 0.203: 37.54,51.08 R17.2
  Bottom 0.508: IC1.2 44.05,51 43.2,50.15 38.47,50.15 R17.2 | v38.51,48.16 37.54,49.12 37.54,51.08
+3V2  (via drill 0.35)
  Top 0.203: DACOUTA.P$2 68.81,5.64 53.06,5.64 41.83,16.87 41.83,23.75 38.89,26.7 U4.4 39.79,41.07 40.85,41.07 v41.31,40.62 | v64.41,43.74 64.41,56.92 64.87,57.38 v65.48,57.38 | v74.47,55.63 74.5,55.63 74.57,55.7 74.57,61.98 80.34,67.74 80.34,76.17 78.03,78.49 C48.1
  Bottom 0.203: DACOUTA.P$2 DACOUTA.P$1 | v41.31,40.62 63.33,40.62 64.41,41.71 v64.41,43.74 | v65.48,57.38 67.44,57.38 69.19,55.63 v74.47,55.63
+3V3  (via drill 0.35)
  Top 0.127: 83.08,51.49 U1.54
  Top 0.203: C5.1 146.03,6.25 | 83.08,51.49 83.24,51.64 83.24,53.59 84.51,54.86 C6.1 | C4.1 75.06,48.59 75.29,48.82 76,48.82 U1.2 77.09,48.95 v77.44,48.59 | v98.12,54.43 99.52,54.43 101.73,56.64 101.73,87.53 v104.88,90.68 | U$3.2 137.16,81.43 141.25,85.52 R38.1 | v89.46,43.79 89.3,43.95 U1.37 | v89.51,10.97 97.16,18.62 102.89,18.62 102.89,23.6 100.69,25.81 C23.+ | C3.1 73.72,44.34 76.02,44.34 U1.11 | v85.88,46.89 86.32,46.45 U1.42 86.89,46.45 86.64,46.19 86.64,46.06 v85.98,45.41 | U1.54 v83.11,50.18 v83.11,50.17 | v83.21,47.75 82.69,48.28 v82.69,48.84 v81.53,48.84 | v82.5,42.19 82.61,42.07 U1.26 82.74,39.84 82.74,39.12 82.87,38.99 83.58,38.99 86,36.58 C1.1
  Top 0.508: 146.03,6.25 146.25,6.48 R2.2 146.25,20.54 SLIDEPOT.3 | v137.21,21.82 137.16,21.87 U$3.2 | U4.8 29.25,40.84 R1.2 | C22.1 106.63,33.38 v106.58,33.43 | R3.1 90.63,25.83 v90.6,25.81
  Bottom 0.203: C3.1 C4.1 | v98.12,54.43 85.57,54.43 C6.1 | 3.3V.P$1 69.32,8.18 71.81,5.69 85.78,5.69 87.88,7.8 87.88,9.35 v89.51,10.97 | v85.88,46.89 84.07,46.89 v83.21,47.75 | v83.11,50.17 83.11,49.27 v82.69,48.84 | v77.44,48.59 81.28,48.59 v81.53,48.84 | v85.98,45.41 86.24,45.16 86.62,45.16 86.88,44.9 87.99,43.79 v89.46,43.79 87.86,42.19 v82.5,42.19 | v104.88,90.68 104.9,90.7 R40.1
  Bottom 0.508: R1.2 28.19,40.87 C14.+ 21.13,40.23 IC3.1 23.7,48.16 33.2,48.16 34.62,49.58 C39.1 38.43,53.57 39.88,53.57 R19.2 64.77,56.31 C4.1 | C22.1 106.58,25.81 C23.+ v90.6,25.81 | R3.1 88.09,34.62 C1.1 C2.1 | 3.3V.P$2 3.3V.P$1 | R40.1 113.08,90.7 113.18,90.81 R36.1 141.12,90.81 R38.1 | v106.58,33.43 116.76,33.43 U$3.10 | v137.21,21.82 144.97,21.82 SLIDEPOT.3
+3V4
  Top 0.203: DACOUTB.P$2 80.03,2.59 76.32,6.3 66.7,6.3 62.87,10.13 50.24,10.13 42.95,17.42 42.95,40.59 41.53,42.01 40.61,42.01 40.13,42.49 40.13,50.8
  Top 0.508: U4.7 36.94,47.26 36.94,47.6 40.13,50.8 52.19,62.86 52.19,73.13 51.21,74.11 C44.2
  Bottom 0.203: DACOUTB.P$2 DACOUTB.P$1
+5V  (via drill 0.35)
  Top 0.203: C47.1 66.85,83.44 66.85,78.59 IC4.6
  Top 0.508: R4.2 11.73,62.66 U2.2 22.28,62.66 C29.+ | IC2.6 42.22,79.27 42.22,82.93 C42.1 | v107.75,3.61 109.78,1.57 112.98,1.57 v113.18,1.37 | IC5.14 149.25,27.16 149.25,24.77 | 149.25,24.77 C16.1 | v55.7,74.57 v55.7,57.66 | 5.0V.P$2 66.9,8.28 63.5,11.68 51,11.68 48.56,14.12 48.56,57.68 v48.59,57.71 | v149.81,3.86 149.81,24.21 149.25,24.77 | U$2.VDD 151.94,43.18 C30.2 149.22,44.68 149.22,49.33 151.92,52.02 R5.2
  Bottom 0.508: IC2.6 39.75,74.37 38.41,73.03 27.84,73.03 22.33,67.51 C29.+ | 5.0V.P$1 5.0V.P$2 71.53,8.89 75.06,12.42 99.03,12.42 107.75,3.71 v107.75,3.61 | v113.18,1.37 147.32,1.37 v149.81,3.86 | C42.1 65,85.29 C47.1 | IC4.6 65.13,76.2 63.48,74.55 55.73,74.55 v55.7,74.57 | C30.2 151.33,40.41 154.03,37.72 154.03,29.29 C16.1 | R6.2 151.92,81.1 153.54,79.48 153.54,71.6 152.55,70.61 R7.2 153.44,69.09 153.44,59.36 R5.2 | v48.59,57.71 55.65,57.71 v55.7,57.66
+9V  (via drill 0.35)
  Top 0.508: v12.5,43.46 12.47,43.43 12.47,41 IC3.3 13.26,40.21 13.26,11.76 v14.3,10.72 | v16.36,48.49 16.36,54.33 U2.3 18.09,56.06 C21.+ | v31.67,9.7 32.99,8.38 32.99,3.79 33.53,3.25 BATT_JUMP.2
  Bottom 0.508: IC3.3 6.83,40.23 C13.+ | v12.5,43.46 12.5,44.76 16.23,48.49 v16.36,48.49 | BATT_JUMP.2 37.76,3.25 38.74,4.23 40.26,4.23 40.27,4.22 48.28,4.22 51.31,1.19 85.47,1.19 90.75,6.48 9V.P$2 9V.P$1 | v14.3,10.72 30.66,10.72 v31.67,9.7
+BAT
  Top 0.508: S1.3 15.62,90.12 15.62,83.86 J2.1
COL1
  Top 0.152: R43.1 63.45,18.01 KEYPAD.COL1
COL2
  Top 0.152: R41.1 68.48,17.96 KEYPAD.COL2
COL3
  Top 0.152: R35.1 KEYPAD.COL3
GND  (via drill 0.35)  (2 unrouted)
  Top 0.127: U1.35 87.66,42.85 87.66,42.49 87.66,42.47 U1.34 | U1.12 76.22,43.87 | 82.58,51.49 U1.55
  Top 0.203: 82.58,51.49 82.74,51.65 82.74,53.63 85.14,56.04 C6.2 | U1.3 75.38,48.45 74.7,47.76 70.78,47.76 C4.2 | C12.2 96.65,42.55 90.12,42.55 | 90.12,42.55 87.71,42.55 87.66,42.49 | C46.2 66.73,48.79 C3.2 71.58,43.95 U1.12 | U1.27 82.99,40.08 82.99,44.26 v83.01,44.27 | v80.14,44.37 79.74,44.37 78.73,43.37 77.42,43.37 76.96,43.82 76.27,43.82 76.22,43.87 | v86.42,44.67 86.61,44.67 86.89,44.95 U1.39 89.22,44.95 90.12,44.04 90.12,42.55
  Top 0.508: IC3.2 14.5,45.34 C28.- 4.29,55.55 4.29,64.52 LED2.K 6.4,69.93 6.4,80.64 J2.2 12.57,86.81 J2.3 | LED1.K 28.25,14.66 34.77,8.13 GND1.P$2 | IC2.7 37.21,76.99 | 37.21,76.99 37.21,77.57 C42.2 | C41.2 35.87,75.64 37.21,76.99 | RESET.4 133.48,8.33 133.48,11.32 133.35,11.45 C15.2 139.7,22.2 139.7,33.17 | 139.7,33.17 U$3.1 | J1.1 112.26,12.55 112.26,14.54 112.04,14.76 SLIDEPOT.1 | C47.2 62.59,77.5 IC4.7 57.86,72.14 57.86,65.43 61.47,61.82 C45.2 | C22.2 106.63,24.37 105.65,25.35 105.65,33.54 96.65,42.55 | 152.78,28.88 151.92,29.74 151.92,34.34 152.81,35.23 IC5.7 155.05,36.5 v152.93,36.5 | C16.2 154.33,27.58 155.63,28.88 | C30.1 154.81,47.65 U$2.VSS | v139.65,46.61 139.65,33.22 139.7,33.17 | C39.2 v29.54,44.96 | v38.68,45.03 38.68,46.47 U4.5 | C1.2 86.13,20.7 v86.11,20.68 | v85.17,65.63 85.17,57.43 C6.2
  Bottom 0.152: C4.2 C3.2
  Bottom 0.203: C11.2 95.66,49 95.66,43.69 C12.2 | v80.14,44.37 82.91,44.37 v83.01,44.27 83.15,44.42 85.34,44.42 85.59,44.67 v86.42,44.67
  Bottom 0.508: C13.- 9.04,38.33 IC3.2 | IC3.2 17.04,35.79 C14.- 27.2,30.35 LED1.K | IC3.2 14.79,38.62 14.79,40.64 22.99,48.84 C21.- | JP3.2 JP3.4 JP3.6 JP3.8 JP3.10 JP3.12 JP3.14 JP3.16 27.43,8.13 GND1.P$2 GND1.P$1 | C5.2 138.02,6.22 RESET.3 RESET.4 122.51,6.3 121.72,7.09 117.72,7.09 J1.1 | C1.2 C2.2 C9.2 C7.2 | C6.2 C10.2 C8.2 69.92,57.4 66.73,60.6 C46.2 66.6,60.6 C45.2 56.21,65.86 C40.2 36.14,65.86 C41.2 30.28,65.58 C29.- 27.41,54.86 23.52,50.98 C21.- | SLIDEPOT.1 110.97,20.68 C22.2 106.58,20.73 C23.- 86.16,20.73 v86.11,20.68 | C21.- 28.32,50.98 C39.2 | BUTTON3.1 123.72,98.27 125.32,99.87 131.57,99.87 BUTTON2.1 138.05,98.58 139.68,100.2 144.93,100.2 BUTTON1.1 153.67,91.47 153.67,83.9 154.31,83.26 FLEX_SENSOR1.2 157.3,81.41 157.3,72.54 156.03,71.27 FLEX_SENSOR2.2 157.28,69.44 157.28,58.75 156.9,58.37 FLEX_SENSOR.2 157.23,56.62 157.23,47.17 157.05,46.99 U$2.VSS 140.03,46.99 v139.65,46.61 | U$3.1 149.94,33.5 v152.93,36.5 | v29.54,44.96 35.08,44.96 35.48,45.36 38.35,45.36 v38.68,45.03 | JP1.1 98.83,65.63 v85.17,65.63
N$1  (via drill 0.35)
  Top 0.203: 53.98,78.08 53.98,32.26 v53.92,32.21 | v88.47,27.03 v88.47,13.78
  Top 0.305: 53.98,78.08 53.98,89.74 SP2.1
  Bottom 0.203: v53.92,32.21 78.63,32.21 83.46,27.38 88.11,27.38 v88.47,27.03 | J1.10 110.86,10.62 106.83,10.62 103.67,13.78 v88.47,13.78
N$3
  Top 0.203: 39.22,99.69 89.66,99.69 90.5,100.53 147.93,100.53 149.24,99.22 149.24,96.63 147.65,95.05 147.65,2.74 146.2,1.29 126.36,1.29 122.19,5.47 122.19,6.41 121.66,6.94 121.6,6.94 118.78,9.76 J1.11
  Top 0.305: 39.22,99.69 37.36,99.69 SP4.1
N$4
  Bottom 0.508: C44.1 51.21,69.9 R20.2
N$5
  Top 0.508: C28.+ U2.1
N$6
  Top 0.508: R20.1 45.39,71.73 R21.2
  Bottom 0.508: IC2.4 45.36,69.19 R20.1
N$9
  Top 0.305: SP4.2 34.67,93.04 IC2.8
N$10
  Top 0.508: C41.1 37.21,61.85 IC2.2
N$12
  Top 0.508: C40.1 41.71,61.14 39.7,63.14 39.7,69.14 IC2.3
N$13  (via drill 0.35)
  Top 0.203: U1.18 78.61,41.22 78.54,41.3 78.54,42.01 v78.59,42.06 | v114.99,35.76 127.28,35.76 U$3.5
  Bottom 0.203: v78.59,42.06 81.91,38.74 91.24,38.74 94.29,35.69 114.91,35.69 v114.99,35.76
N$16
  Top 0.203: IC5.3 157.43,30.15 157.89,30.61 157.89,36.96 U$2.VIN
N$30
  Top 0.203: R47.2 75.82,72.42 C48.2
N$65
  Top 0.203: R48.2 71.58,70.1 R47.1
  Bottom 0.508: R47.1 70.71,69.24 IC4.4
N$68
  Top 0.305: IC4.8 60.05,87.63 SP2.2
N$69
  Top 0.508: IC4.2 62.59,66.8 C45.1
N$70
  Top 0.508: IC4.3 66.73,67.64 C46.1
OSC0
  Top 0.203: C12.1 93.16,45.09 Y1.OSC0 90.17,45.45 U1.40
OSC1
  Top 0.203: C11.1 96.62,47.77 Y1.OSC1 90.02,45.95 U1.41
PB0  (via drill 0.35)
  Top 0.152: v53.06,26.72 53.21,26.57 KEYPAD.ROW2
  Top 0.203: JP3.1 6.86,7.87 8.46,7.87 9.37,8.79 9.37,25.28 10.53,26.44 11.25,26.44 v11.53,26.72 | v84.91,47.38 84.91,46.53 85.49,45.95 85.49,41.8 87.05,40.25 87.05,16.87 v86.62,16.44 | U1.45 86.89,47.95 86.47,48.36 v85.98,48.36
  Bottom 0.152: v86.62,16.44 54.7,16.44 KEYPAD.ROW2 | v53.06,26.72 v11.53,26.72
  Bottom 0.203: v85.98,48.36 85,47.38 v84.91,47.38
PB1  (via drill 0.35)
  Top 0.152: v98.91,49.96 97.92,48.98 89.39,48.98 88.86,48.45 U1.46 | KEYPAD.ROW3 55.73,17.96 v55.73,25.6
  Top 0.203: JP3.3 10.01,8.48 10.01,25.02 10.74,25.76 v11.53,25.76 | v101.6,48.44 101.6,38.84 v101.7,38.73 | v92.05,38.71 94.03,36.73 v94.03,24.39
  Bottom 0.152: v94.03,24.39 62.21,24.39 KEYPAD.ROW3 | v55.73,25.6 55.58,25.76 v11.53,25.76
  Bottom 0.203: v101.6,48.44 100.43,48.44 v98.91,49.96 | v101.7,38.73 92.08,38.73 v92.05,38.71
PB2  (via drill 0.35)
  Top 0.152: 94.04,49.64 94.03,49.63 89,49.63 88.31,48.95 U1.47
  Top 0.203: v101.42,52.73 97.13,52.73 94.04,49.64 | JP3.5 10.69,23.98 v11.56,24.84 | v106.76,52.78 106.76,35.94 v105.77,34.95 | v95.81,34.95 95.81,24.89 v95.83,24.87
  Bottom 0.152: v95.83,24.87 60.55,24.87 R35.2 56.01,24.84 v11.56,24.84
  Bottom 0.203: v101.42,52.73 101.47,52.78 v106.76,52.78 | v105.77,34.95 v95.81,34.95
PB3  (via drill 0.35)
  Top 0.152: 93.9,49.97 93.89,49.96 88.86,49.96 88.34,49.45 U1.48 | KEYPAD.ROW4 60.83,15.75 v60.63,15.54 | 11.48,8.38 11.48,15.54 v11.53,15.6
  Top 0.203: 93.9,49.97 96.99,53.06 99.67,53.06 v100.71,54.1 | v144.53,54.28 145.92,52.88 v145.92,23.93 | 11.48,8.38 JP3.7
  Bottom 0.152: v145.92,23.93 66.83,23.93 KEYPAD.ROW4 | v11.53,15.6 11.58,15.54 v60.63,15.54
  Bottom 0.203: v100.71,54.1 144.35,54.1 v144.53,54.28
PB4  (via drill 0.35)
  Top 0.152: U1.58 80.97,51.58 80.97,52.25 79.68,53.54 76.89,53.54 v76.56,53.87 | v67.77,51.94 68.26,51.94 70.19,53.87 v70.99,53.87 | v65.13,51.94 65.13,28.96 R43.2
  Bottom 0.152: v67.77,51.94 v65.13,51.94 | v76.56,53.87 v70.99,53.87
PB5  (via drill 0.35)
  Top 0.152: U1.57 81.47,51.58 81.47,52.25 79.9,53.82 77.65,53.82 77.24,54.23 v77.24,54.33 | v67.33,52.58 68.5,52.58 70.26,54.34 71.46,54.34 v71.48,54.36 | v66.02,52.58 66.02,18.03 KEYPAD.ROW1
  Bottom 0.152: v67.33,52.58 v66.02,52.58 | v77.24,54.33 77.22,54.36 v71.48,54.36
PB6  (via drill 0.35)
  Top 0.152: U1.1 v74.28,49.45 v74.27,49.45 | v70.69,40.41 70.69,29.49 R41.2
  Bottom 0.152: v74.27,49.45 74.27,47.07 74.88,46.46 74.88,44.6 v70.69,40.41
PD4  (via drill 0.35)
  Top 0.203: U1.43 89.12,46.95 v89.2,46.86 | v102.84,13.26 107.88,13.26 109.21,14.59 109.21,24.14 110.32,25.25 SLIDEPOT.2 112.09,25.29 v112.09,41.53 | v94.03,46.84 v94.03,45.62
  Bottom 0.203: JP3.9 17.88,8.74 34.11,8.74 38.63,13.26 v102.84,13.26 | v89.2,46.86 94,46.86 v94.03,46.84 | v94.03,45.62 95.22,44.42 95.22,42.08 95.99,41.32 111.88,41.32 v112.09,41.53
PD5  (via drill 0.35)
  Top 0.203: BUTTON1.2 141.25,98.45 R38.2 139.8,96.01 138.91,95.12 138.91,85.22 v136.14,82.45 | U1.44 87.57,47.47 85.6,47.47 85.19,47.88 85.19,49.07 85.8,49.68 86.44,49.68 87.1,50.34 87.1,52.76 | JP3.11 20.4,8.71 20.4,43.61 v23.09,46.3 | 87.1,52.76 86.51,53.34 v86.46,53.34 | v69.88,52.9 69.51,52.53 69.27,52.53 67.76,51.01 v67.28,51.01 | 87.1,52.76 v87.1,80.37
  Bottom 0.203: v136.14,82.45 133.45,79.76 87.71,79.76 v87.1,80.37 | v86.46,53.34 86.44,53.37 70.35,53.37 v69.88,52.9 | v67.28,51.01 67.12,50.85 63.05,50.85 57.33,45.14 39.74,45.14 38.58,46.3 v23.09,46.3
PD6  (via drill 0.35)
  Top 0.203: BUTTON2.2 127.66,98.55 R36.2 120.09,88.32 107.54,88.32 103.61,84.38 103.61,52.09 97.79,46.28 v95.02,46.28 | v84.78,44.91 84.02,45.67 84.02,47.7 83.61,48.11 U1.53 83.61,52.72 v83.73,52.83 | JP3.13 23.06,8.84 v23.06,45.36 | v69.88,52.2 69.64,52.2 v68.12,50.68
  Bottom 0.203: v95.02,46.28 87.82,46.28 87.56,46.02 85.9,46.02 v84.78,44.91 | v23.06,45.36 23.67,45.97 38.44,45.97 39.61,44.81 57.47,44.81 63.19,50.52 67.96,50.52 v68.12,50.68 | v83.73,52.83 70.51,52.83 v69.88,52.2
PD7  (via drill 0.35)
  Top 0.203: BUTTON3.2 113.33,98.22 R40.2 102.64,85.09 102.64,52.5 98.57,48.43 96.46,48.43 96.39,48.36 v94.67,48.36 | v82.78,46.35 79.3,46.35 v79.2,46.25 | v77.67,44.83 77.56,44.95 U1.10 v74.25,44.95 | JP3.15 23.39,41.86 v24.38,42.85
  Bottom 0.203: v82.78,46.35 87.43,46.35 v89.26,48.18 94.49,48.18 v94.67,48.36 | v77.67,44.83 79.1,46.25 v79.2,46.25 | v24.38,42.85 25.52,43.98 57.58,43.98 58,44.4 73.37,44.4 73.92,44.95 v74.25,44.95
PE0  (via drill 0.35)  (1 unrouted)
  Top 0.152: U1.9 73.75,45.45 72.58,46.62 69.58,46.62 68.19,48.01 68.19,48.24 v67.56,48.87 | v67.56,46.41 74.68,39.29 v74.68,19.3 | v157.1,19.68 157.1,26.84
  Bottom 0.152: v67.56,48.87 v67.56,46.41 | v74.68,19.3 156.72,19.3 v157.1,19.68
PE1  (via drill 0.35)
  Top 0.152: U1.8 73.88,45.95 72.92,46.9 69.7,46.9 68.53,48.07 68.53,49.27 69.28,50.01 70.58,50.01 77.06,56.49 77.06,59.33 77.06,59.36 v77.06,60.45
  Top 0.203: R5.1 155.07,62.92 FLEX_SENSOR.1
  Bottom 0.152: v77.06,60.45 149.45,60.45 R5.1
PE2  (via drill 0.35)
  Top 0.152: U1.7 73.88,46.45 73.14,47.18 69.83,47.18 68.83,48.18 68.83,48.84 68.83,48.95 68.83,49.17 69.39,49.73 70.7,49.73 71.46,50.49 71.47,50.5 77.34,56.38 77.34,59.79 77.98,60.43 78,60.43 v78,61.49
  Top 0.203: R7.1 155.17,75.69 FLEX_SENSOR2.1
  Bottom 0.152: v78,61.49 137.72,61.49 R7.1
PE3  (via drill 0.35)
  Top 0.152: U1.6 73.86,46.95 73.35,47.46 69.95,47.46 69.15,48.26 69.15,49.02 69.52,49.39 70.75,49.39 77.62,56.26 77.62,59.31 78.92,60.6 v78.92,62.64
  Top 0.203: R6.1 154.99,87.86 FLEX_SENSOR1.1
  Bottom 0.152: v78.92,62.64 126.69,62.64 R6.1
POWERLED
  Top 0.203: R1.1 28.22,32.92 LED1.A
POWERLED1
  Top 0.508: R4.1 9.78,65.79 11.4,65.79 12.12,66.5 12.12,69.62 10.44,71.3 8.53,71.3 LED2.A
POWERLED3  (via drill 0.35)
  Top 0.203: v132,17.8 132,32.3 131.18,33.13 131.18,33.88 131.98,34.68 131.98,76.4 v129.95,78.44
  Bottom 0.203: J1.2 114.38,16.64 130.84,16.64 v132,17.8 | v129.95,78.44 85.11,78.44 81.58,81.97 75.21,81.97 R48.1
  Bottom 0.508: IC4.5 69.14,78.33 R48.1
POWERLED14
  Top 0.508: R17.1 42.57,49.16 41.64,48.23 41.64,43.73 R18.2
  Bottom 0.508: R17.1 43.28,51.13 IC1.1
POWERLED15
  Bottom 0.508: R18.1 45.06,47.83 IC1.3
POWERLED17  (via drill 0.35)
  Top 0.203: R21.1 46.25,86.23 40.51,91.97 36.68,91.97 v36.65,91.95 | v2.97,92.02 2.97,5.05 2.44,4.52 2.44,2.23 v3,1.68
  Bottom 0.203: J1.3 117.11,9.36 115.34,9.36 114.85,8.88 114.85,8.33 107.24,0.71 51.08,0.71 50.12,1.68 v3,1.68 | v2.97,92.02 36.58,92.02 v36.65,91.95
  Bottom 0.508: IC2.5 45.39,76.81 R21.1
RESET  (via drill 0.35)
  Top 0.203: RESET.1 137.95,13.79 C15.1 | RESET.2 129.62,12.65 129.62,25.83 128.91,26.54 v126.62,26.54 | v102.64,27.05 97.41,32.28 97.41,34.57 90.41,41.57 86.77,41.57 86.4,41.94 85.83,41.94 85.83,43.38 86.77,44.32 87.48,44.32 U1.38
  Bottom 0.203: R2.1 141.05,10.82 RESET.1 RESET.2 | v126.62,26.54 109.37,26.54 108.86,27.05 v102.64,27.05
SSI_FS  (via drill 0.35)
  Top 0.203: U4.3 36.88,41.23 36.88,41.1 36.55,40.78 v36.55,40.36 | U1.62 79.11,50.04 78.63,49.56 78.63,49.15 78.69,49.09 v78.69,44.42
  Bottom 0.203: v36.55,40.36 37.03,39.88 72.11,39.88 76.48,44.25 77.79,44.25 77.95,44.41 78.67,44.41 v78.69,44.42
SSI_MOSI  (via drill 0.35)
  Top 0.203: U4.1 35.08,39.8 36.04,38.84 v37.41,38.84 | v78.16,43.92 v78.17,43.93 78.17,51.38 U1.64
  Bottom 0.203: v37.41,38.84 72.34,38.84 77.42,43.92 v78.16,43.92
SSI_SCK  (via drill 0.35)
  Top 0.152: U1.61 79.47,51.58 79.47,52.25 79.27,52.45 77.32,52.45 v77.04,52.17 | v70.71,51.79 69.37,50.44 v68.94,50.44
  Top 0.203: U4.2 36.35,43.13 35.71,43.76 35.71,44.2 v35.99,44.48
  Bottom 0.152: v77.04,52.17 71.09,52.17 v70.71,51.79
  Bottom 0.203: v35.99,44.48 57.61,44.48 63.32,50.19 68.68,50.19 v68.94,50.44
ST7735_DC  (via drill 0.35)
  Top 0.203: U1.23 81.24,39.84 81.24,38.62 82.13,37.72 84.1,37.72 v84.25,37.57
  Bottom 0.203: v84.25,37.57 89.33,37.57 96.5,30.4 130.38,30.4 132.08,32.11 U$3.4
ST7735_MISO  (via drill 0.35)
  Top 0.203: U1.21 80.11,38.56 78.69,37.13 78.69,32.84 v79.5,32.03 | v118.39,28.32 118.39,32.51 U$3.9
  Bottom 0.203: v79.5,32.03 83.82,27.71 117.78,27.71 v118.39,28.32
ST7735_MOSI  (via drill 0.35)
  Top 0.203: U1.22 80.61,37.39 81.25,36.75 v81.25,31.6 | v88.8,31.6 88.8,35.79 89.48,36.47 92.35,36.47 v92.46,36.37
  Bottom 0.203: U$3.7 124.46,31.27 124.13,30.94 124.1,30.96 98.32,30.96 92.91,36.37 v92.46,36.37 | v81.25,31.6 v88.8,31.6
ST7735_RST  (via drill 0.35)
  Top 0.203: U1.24 81.74,39.84 81.74,39.12 81.86,39 81.86,38.46 82.07,38.25 v82.4,38.25
  Bottom 0.203: v82.4,38.25 82.4,37.04 82.28,36.92 82.28,36.23 83.65,34.87 86.47,34.87 92.08,29.26 132.72,29.26 134.62,31.17 U$3.3
ST7735_SCK  (via drill 0.35)
  Top 0.203: U1.19 79.11,41.5 80.82,43.2 v80.82,43.26
  Bottom 0.203: U$3.8 120.66,33.5 113.5,40.66 81.1,40.66 80.33,41.43 80.33,41.83 80.82,42.33 v80.82,43.26
ST7735_TFT_CS  (via drill 0.35)
  Top 0.203: U1.20 79.74,40.08 79.74,40.79 80.14,41.19 80.14,41.35 80.42,41.63 v80.82,41.63
  Bottom 0.203: U$3.6 119.52,40.99 81.47,40.99 v80.82,41.63
SWITCHEDPOWER
  Top 0.508: BATT_JUMP.1 39.5,22.84 37.29,25.04 37.29,29.29 25.76,40.82 25.76,88.54 18.47,95.83 11.35,95.83 10.39,96.8 S1.2
TCK  (via drill 0.35)
  Top 0.203: U1.52 84.11,52.52 86.77,55.18 86.77,75.16 v86.03,75.89
  Bottom 0.203: v86.03,75.89 JP1.5
TDI  (via drill 0.35)
  Top 0.203: v88.44,70.87 88.44,52.28 88.44,52.27 88.44,50.2 v88.35,50.11 | U1.50 85.11,50.44 v84.63,49.96
  Bottom 0.203: JP1.3 88.49,70.81 v88.44,70.87 | v84.63,49.96 84.78,50.11 v88.35,50.11
TDO  (via drill 0.35)
  Top 0.203: U1.49 v86.41,51.43 v86.41,51.44 | v89.2,51.94 v89.2,68.28
  Bottom 0.203: v86.41,51.44 86.92,51.94 v89.2,51.94 | v89.2,68.28 JP1.2
TMS  (via drill 0.35)
  Top 0.203: U1.51 84.61,52.3 v85.17,52.85 | v87.95,52.84 87.95,73.34 v87.96,73.36
  Bottom 0.203: v85.17,52.85 87.93,52.85 87.94,52.86 v87.95,52.84 | v87.96,73.36 JP1.4
VDDC  (via drill 0.35)
  Top 0.127: 82.07,51.48 U1.56
  Top 0.203: C10.1 82.12,51.52 82.07,51.48 | U1.25 81.99,40.08 81.99,42.78 81.03,43.75 | 81.03,43.75 79.58,43.75 77.22,41.38 v77.22,39.98 | v81.13,50.22 81.38,50.47 81.86,50.47 82.11,50.72 U1.56 | v79.12,49.35 79.59,48.88 79.59,47.4 80.14,46.85 v82.22,46.85 | v82.09,45.86 82.09,44.3 81.54,43.75 81.03,43.75
  Bottom 0.203: C8.1 C10.1 | C9.1 77.55,38.94 77.37,38.94 77.22,39.09 v77.22,39.98 | v81.13,50.22 80.26,49.35 v79.12,49.35 | v82.22,46.85 82.22,45.99 v82.09,45.86
  Bottom 0.508: C7.1 C9.1
WAKE  (via drill 0.35)
  Top 0.203: U1.32 86.34,39.23 v86.36,39.23
  Bottom 0.203: v86.36,39.23 90.16,39.23 R3.2

### Text on the board
bPlace: Cole Choe / Jesse Valdelamar / Wilson Odom / Ravi Akalkotkar
tSilk: BATT
_bsilk: ON.OFF